# EAGLE design D1MSHO (EAGLE 6.1)
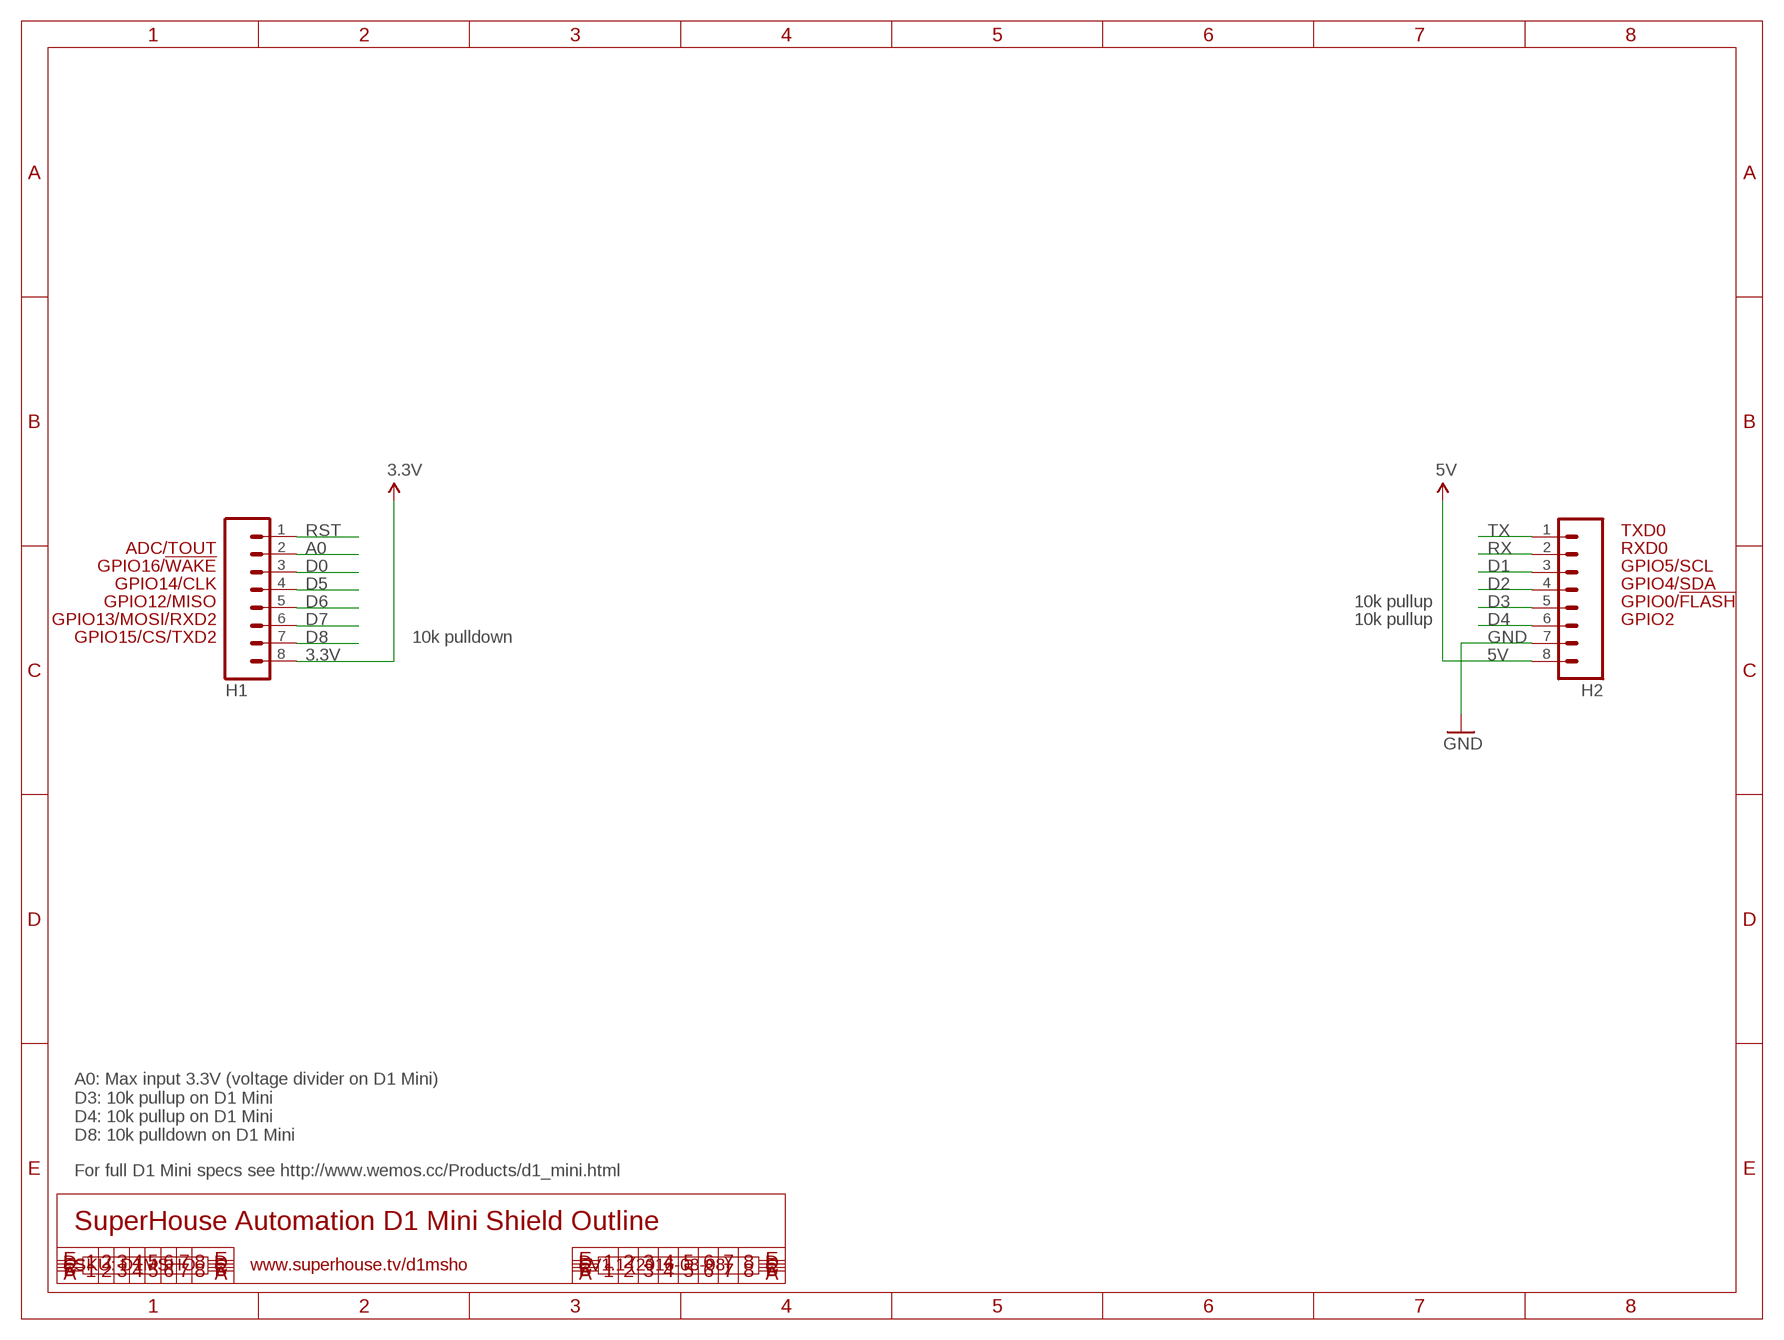
[diagram p0: schematic, sheet 1]

## Parts
H1  M08  [1X08]
H2  M08  [1X08]

## Nets
3.3V: H1.8
5V: H2.8
A0: H1.2
D0: H1.3
D1: H2.3
D2: H2.4
D3: H2.5
D4: H2.6
D5: H1.4
D6: H1.5
D7: H1.6
D8: H1.7
GND: H2.7
RST: H1.1
RX: H2.2
TX: H2.1

## Notes on the sheet
- TXD0
- ADC/TOUT | RXD0
- GPIO16/!WAKE | GPIO5/SCL
- GPIO14/CLK | GPIO4/SDA
- GPIO12/MISO | 10k pullup | GPIO0/!FLASH
- GPIO13/MOSI/RXD2 | 10k pullup | GPIO2
- GPIO15/CS/TXD2 | 10k pulldown
- A0: Max input 3.3V (voltage divider on D1 Mini)
  D3: 10k pullup on D1 Mini
  D4: 10k pullup on D1 Mini
  D8: 10k pulldown on D1 Mini
- For full D1 Mini specs see http://www.wemos.cc/Products/d1_mini.html
- SuperHouse Automation D1 Mini Shield Outline
- SKU: D1MSHO | www.superhouse.tv/d1msho | V1.1 (2016-03-08)

## Library data of the parts
H1 H2 = freetronics-original:M08: Header 8 Standard 8-pin 0.1" header. Use with straight break away headers (SKU : PRT-00116), right angle break away headers (PRT-00553), swiss pins (PRT-00743), machine pins (PRT-00117), and female headers (PRT-00115).

## Net classes
0 default: width 0.203 mm, drill 0.356 mm, clearance 0.152 mm
1 power: width 0.203 mm, clearance 0.152 mm

## Board
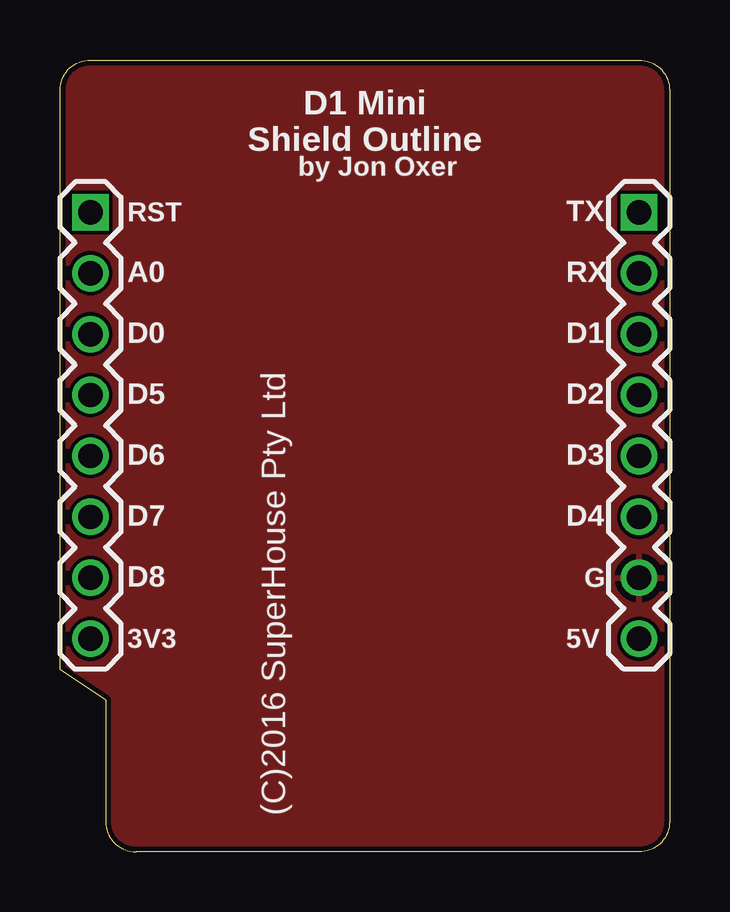
[diagram p1: board, top side]
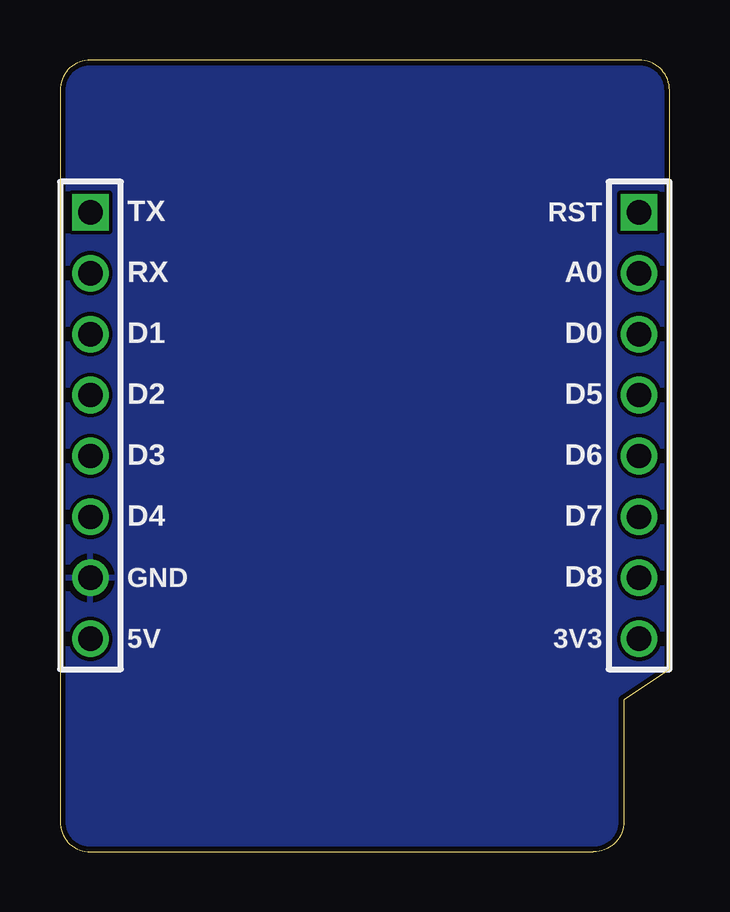
[diagram p2: board, bottom side, seen from below]

Size 25.4 x 33.02 mm. Coordinates in mm from the lower left corner, seen from the top.
Outline: 25.4,31.75 25.4,1.27 arc-90 24.13,0 3.17,0 arc-90 1.91,1.27 1.91,6.35 0,7.62 0,31.75 arc-90 1.27,33.02 24.13,33.02 arc-90 25.4,31.75
Copper layers (1*16): Top 0.035mm / dielectric 1.5mm / Bottom 0.035mm
Design rules: minimum track width 6mil, minimum drill 12mil, track to track 6mil, track to pad 6mil, pad to pad 6mil, via to via 6mil, smd to smd 6mil, copper to edge 8mil, drill to drill 6mil, minimum pad ring 10mil, minimum via ring 6mil, stop-mask expansion 4mil, vias tented up to drill 100mil, thermal gap 10mil

### Footprints (pad centres in the part's own frame; a part is rotated, then mirrored left to right if it is on the bottom)
1X08 = drill 1.016 square: 1 0,0 | drill 1.016: 2 2.54,0; 3 5.08,0; 4 7.62,0; 5 10.16,0; 6 12.7,0; 7 15.24,0; 8 17.78,0

### Placement (x,y rotation side)
H1  1.27,26.67 270 top
H2  24.13,26.67 270 top

### Tracks (layer width: path | path; a pad name or v marks a point on that pad's centre or on a via)
GND
  pour Top: 25.4,31.75 arc90 24.13,33.02 1.27,33.02 arc90 0,31.75 0,7.62 1.91,6.35 1.91,1.27 arc90 3.17,0 24.13,0 arc90 25.4,1.27
  pour Bottom: 25.4,1.27 25.4,31.75 arc90 24.13,33.02 1.27,33.02 arc90 0,31.75 0,7.62 1.91,6.35 1.91,1.27 arc90 3.17,0 24.13,0 arc90

### Text on the board
tPlace: D1 Mini / Shield Outline | by Jon Oxer | RST | TX | A0 | RX | D0 | D1 | D5 | D2 | D6 | D3 | D7 | D4 | D8 | G | 3V3 | 5V | (C)2016 SuperHouse Pty Ltd
bPlace: RST | TX | A0 | RX | D0 | D1 | D5 | D2 | D6 | D3 | D7 | D4 | D8 | GND | 3V3 | 5V